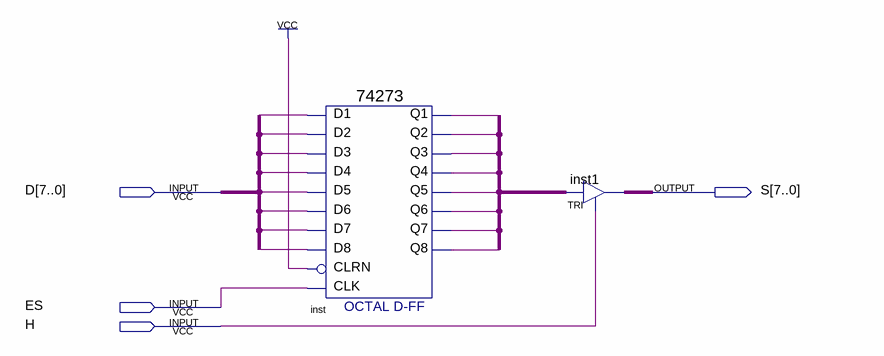
[diagram p0: schematic sheet]
// Quartus schematic TMP - RegistradorTemporario.bdf as structural Verilog: 2 symbols, 4 pins
module \TMP_-_RegistradorTemporario  (
  input  [7:0] D,
  input  ES,
  input  H,
  output [7:0] S
);

  wire inst_q1, inst_q2, inst_q3, inst_q4, inst_q5, inst_q6, inst_q7, inst_q8, undriven_2, undriven_3,
       undriven_4, undriven_5, undriven_6, undriven_7, undriven_8, undriven_9;
  wire [7:0] undriven;

  \74273  inst (
    .D2(undriven_3), .D3(undriven_4), .D1(undriven_2), .D4(undriven_5), .D7(undriven_9), .D6(undriven_7),
    .D5(undriven_6), .D8(undriven_8), .CLK(ES), .CLRN(1'b1), .Q4(inst_q4), .Q1(inst_q1), .Q2(inst_q2),
    .Q3(inst_q3), .Q6(inst_q6), .Q5(inst_q5), .Q7(inst_q7), .Q8(inst_q8));
  TRI inst1[7:0] (.IN(undriven), .OE(H), .OUT(S));
endmodule
